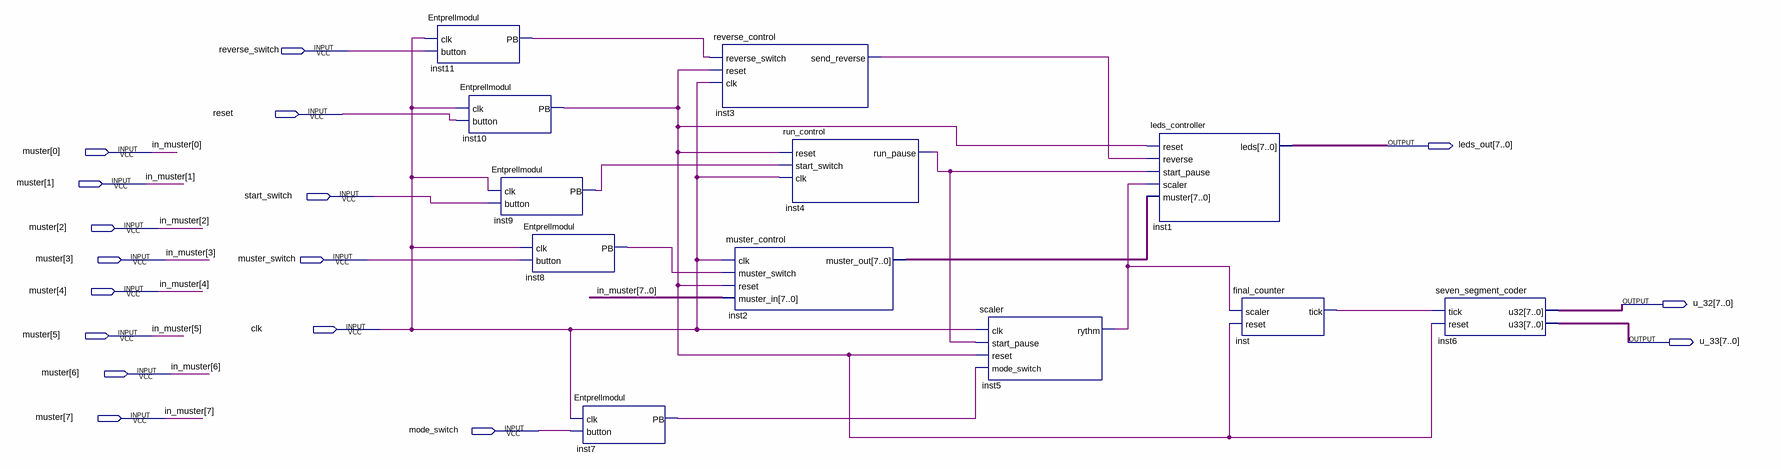
[diagram p0: schematic sheet]
// Quartus schematic lauflicht.bdf as structural Verilog: 12 symbols, 17 pins
module lauflicht (
  input  reverse_switch,
  input  reset,
  input  [7:0] muster,
  input  start_switch,
  input  muster_switch,
  input  clk,
  input  mode_switch,
  output [7:0] leds_out,
  output [7:0] u_32,
  output [7:0] u_33
);

  wire inst3_send_reverse, inst4_run_pause, inst5_rythm, inst7_pb, inst8_pb, inst9_pb, inst10_pb, inst11_pb,
       inst_tick;
  wire [7:0] inst2_muster_out;

  Entprellmodul inst11 (.clk(clk), .button(reverse_switch), .PB(inst11_pb));
  Entprellmodul inst10 (.clk(clk), .button(reset), .PB(inst10_pb));
  Entprellmodul inst9 (.clk(clk), .button(start_switch), .PB(inst9_pb));
  Entprellmodul inst8 (.clk(clk), .button(muster_switch), .PB(inst8_pb));
  Entprellmodul inst7 (.clk(clk), .button(mode_switch), .PB(inst7_pb));
  reverse_control inst3 (.reverse_switch(inst11_pb), .reset(inst10_pb), .clk(clk), .send_reverse(inst3_send_reverse));
  muster_control inst2 (
    .clk(clk), .muster_switch(inst8_pb), .reset(inst10_pb), .muster_in(muster), .muster_out(inst2_muster_out));
  run_control inst4 (.reset(inst10_pb), .start_switch(inst9_pb), .clk(clk), .run_pause(inst4_run_pause));
  scaler inst5 (
    .clk(clk), .start_pause(inst4_run_pause), .reset(inst10_pb), .mode_switch(inst7_pb), .rythm(inst5_rythm));
  leds_controller inst1 (
    .reset(inst10_pb), .reverse(inst3_send_reverse), .start_pause(inst4_run_pause), .scaler(inst5_rythm),
    .muster(inst2_muster_out), .leds(leds_out));
  final_counter inst (.scaler(inst5_rythm), .reset(inst10_pb), .tick(inst_tick));
  seven_segment_coder inst6 (.tick(inst_tick), .reset(inst10_pb), .u32(u_32), .u33(u_33));

  // Other names for the same wires on the sheet: in_muster[7:0] = muster
endmodule
